# EasyEDA Pro project 信号发生器.eprj

# Schematic SCH_AD9833可编程波形发生器模块
Create Date: 2023-05-23; Page Name: P1; Project Name: 【电赛模块】AD9833可编程波形发生器模块; Schematic Name: SCH_AD9833可编程波形发生器模块; Update Date: 2023-06-13; Company: 深圳嘉立创科技集团股份有限公司; Drawed: LCEDA_02; Page Size: A5; Part Number: JLC-PCB-001; Reviewed: 嘉立创EDA; Version: V1.0
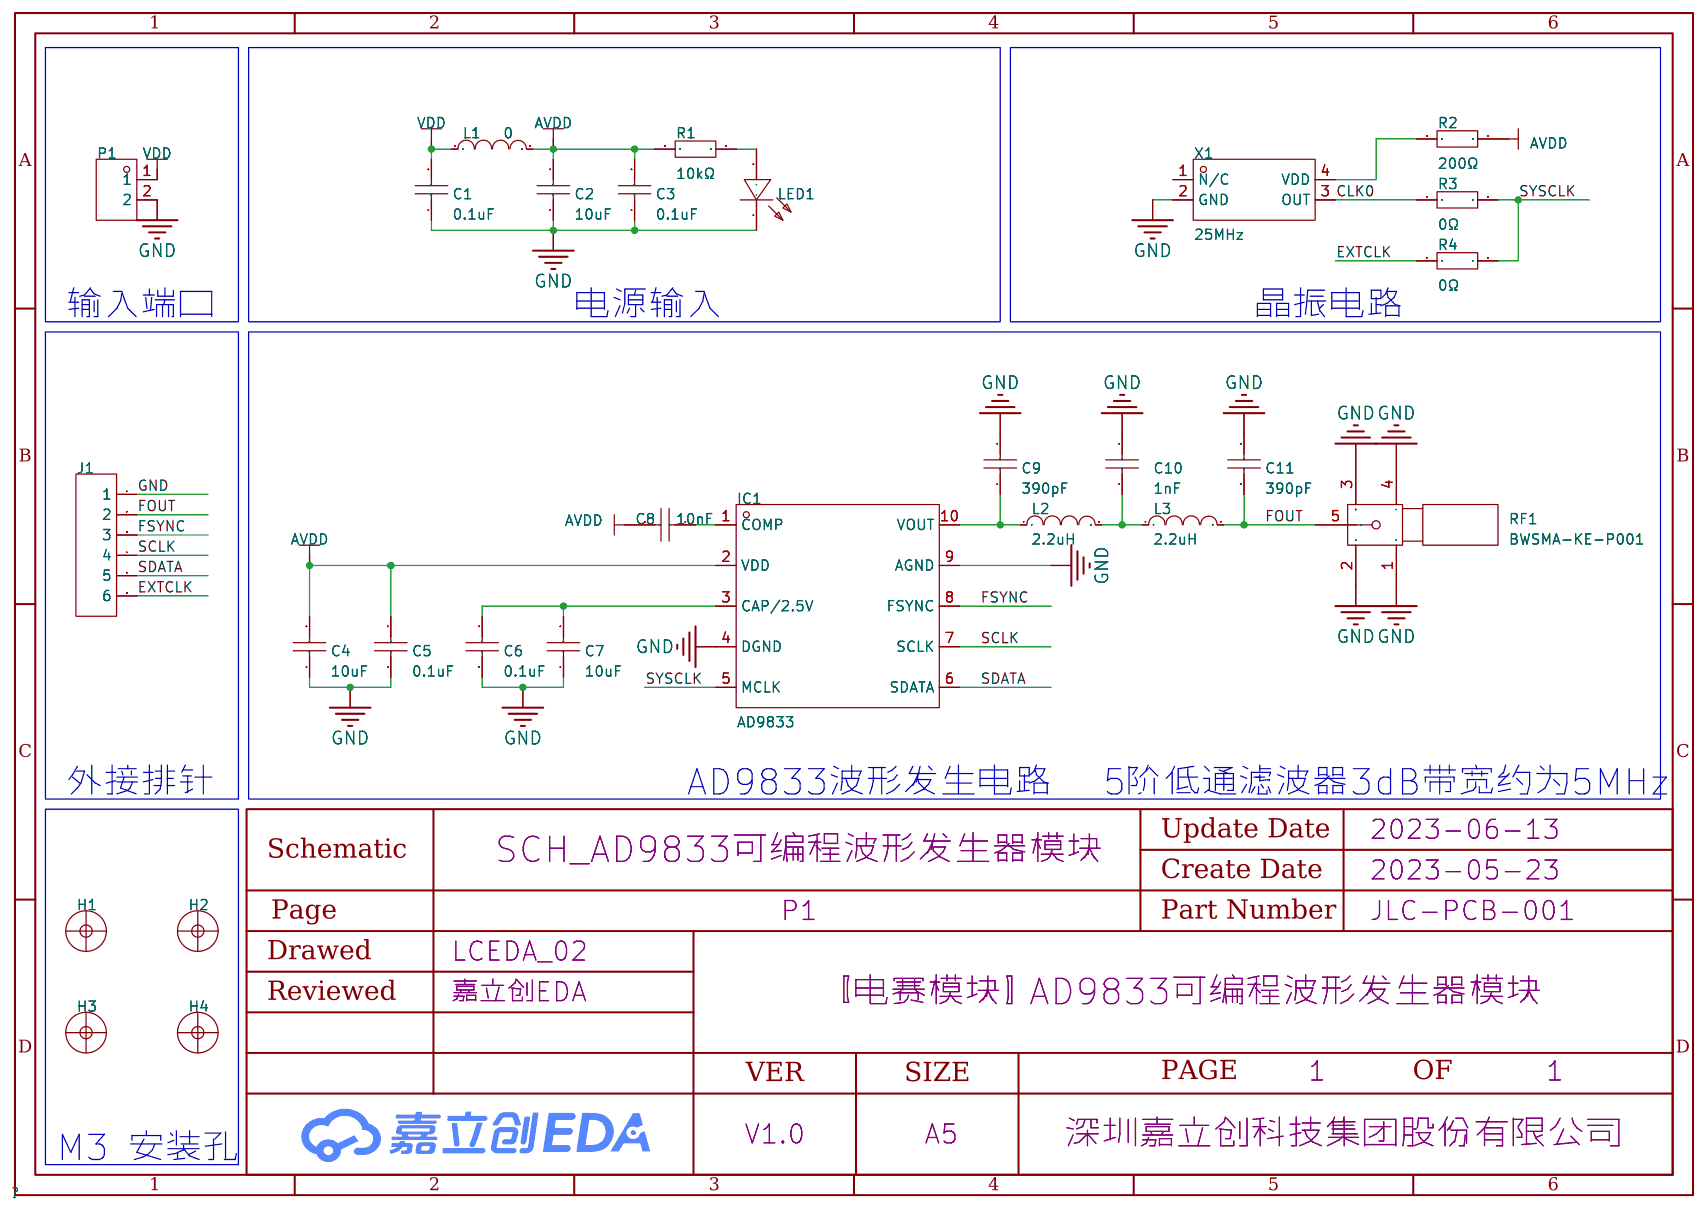
[diagram p0: schematic sheet]

## Parts
C1  0.1uF  [C0805]
C2  10uF  [C0805]
C3  0.1uF  [C0805]
C4  10uF  [C0805]
C5  0.1uF  [C0805]
C6  0.1uF  [C0805]
C7  10uF  [C0805]
C8  10nF  [C0805]
C9  390pF  [C0805]
C10  1nF  [C0805]
C11  390pF  [C0805]
H1  -  [M3X10-6]
H2  -  [M3X10-6]
H3  -  [M3X10-6]
H4  -  [M3X10-6]
IC1  AD9833  [MSOP-10_L3.0-W3.0-P0.50-LS5.0-BL]
J1  2.54-1x6P直针  [HDR-TH_6P-P2.54-V-M-1]
L1  0  [L0805]
L2  2.2uH  [L0805]
L3  2.2uH  [L0805]
LED1  NCD0805R1  [LED0805-RD_RED]
P1  KF301-5.0-2P  [CONN-TH_P5.00_KF301-5.0-2P]
R1  10kΩ  [R0805]
R2  200Ω  [R0805]
R3  0Ω  [R0805]
R4  0Ω  [R0805]
RF1  BWSMA-KE-P001  [SMA-SMD_BWSMA-KE-P001]
X1  25MHz  [OSC-SMD_4P-L7.0-W5.0-BL]

## Library data of the parts
C1 C3 C5 C6 = CL21B104KCFNNNE: 容值:100nF;精度:±10%;额定电压:100V;材质(温度系数):X7R;; LCSC Part Name: 100nF ±10% 100V; Supplier Part: C28233; Manufacturer: SAMSUNG(三星); Supplier Footprint: 0805; JLCPCB Part Class: Basic Part; Datasheet: https://atta.szlcsc.com/upload/public/pdf/source/20160103/1457707716102.pdf; Supplier: LCSC; Tolerance: ±10%; Voltage Rated: 100V; Temperature Coefficient: X7R
C2 C4 C7 = CL21A106KAYNNNE_C15850: 容值:10uF;精度:±10%;额定电压:25V;材质(温度系数):X5R;; LCSC Part Name: 10uF ±10% 25V; Supplier Part: C15850; Manufacturer: SAMSUNG(三星); Manufacturer Part: CL21A106KAYNNNE; Supplier Footprint: 0805; JLCPCB Part Class: Basic Part; Datasheet: https://atta.szlcsc.com/upload/public/pdf/source/20160103/1457707679302.pdf; Supplier: LCSC; Tolerance: ±10%; Voltage Rated: 25V; Temperature Coefficient: X5R
C8 = CL21B103KBANNNC: 容值:10nF;精度:±10%;额定电压:50V;材质(温度系数):X7R;; LCSC Part Name: 10nF ±10% 50V; Supplier Part: C1710; Manufacturer: SAMSUNG(三星); Supplier Footprint: 0805; JLCPCB Part Class: Basic Part; Datasheet: https://atta.szlcsc.com/upload/public/pdf/source/20160103/1457707693082.pdf; Supplier: LCSC; Tolerance: ±10%; Voltage Rated: 50V; Temperature Coefficient: X7R
C9 C11 = CL21C391JBANNNC: 容值:390pF;精度:±5%;额定电压:50V;材质(温度系数):C0G;; LCSC Part Name: 390pF ±5% 50V; Supplier Part: C318736; Manufacturer: SAMSUNG(三星); Supplier Footprint: 0805; JLCPCB Part Class: Extended Part; Datasheet: https://atta.szlcsc.com/upload/public/pdf/source/20190402/C318736_5E6ECF47E5B862995D4CB4A0A4560FE2.pdf; Supplier: LCSC; Tolerance: ±5%; Voltage Rated: 50V; Temperature Coefficient: C0G
C10 = CL21B102KBCNNNC: 容值:1nF;精度:±10%;额定电压:50V;材质(温度系数):X7R;; LCSC Part Name: 1nF ±10% 50V; Supplier Part: C46653; Manufacturer: SAMSUNG(三星); Supplier Footprint: 0805; JLCPCB Part Class: Basic Part; Datasheet: https://atta.szlcsc.com/upload/public/pdf/source/20160103/1457707727583.pdf; Supplier: LCSC; Tolerance: ±10%; Voltage Rated: 50V; Temperature Coefficient: X7R
H1-H4 = M3x10+6: Manufacturer: Shuntian(顺天五金); Supplier Part: C551322; Supplier: LCSC; JLCPCB Part Class: 扩展库
IC1 = AD9833BRMZ-REEL7_C9652: 自宽调谐(最大值):28 b;; LCSC Part Name: AD9833BRMZ; Supplier Part: C9652; Manufacturer: ADI(亚德诺)/LINEAR(凌特); Supplier Footprint: MSOP-10; JLCPCB Part Class: Extended Part; Datasheet: https://atta.szlcsc.com/upload/public/pdf/source/20121029/1457706544172.pdf; Supplier: LCSC; Tuning  Word Width(Max): 28 b
J1 = 2.54-1x6P直针: 排数:单排;总PIN位数:6;间距:2.54mm;插针结构:1x6P;行距:-;安装类型:直插;圆针/方针:方针;额定电流:3A;额定电压:-;配合针长度:-;塑高:-;触头材质:黄铜;触头镀层:-;工作温度范围:-40℃~+105℃;颜色:黑色;; LCSC Part Name: 2.54mm 1x6P 直插 方针; Supplier Part: C37208; Manufacturer: BOOMELE(博穆精密); Supplier Footprint: 直插,P=2.54mm; JLCPCB Part Class: Extended Part; Datasheet: https://atta.szlcsc.com/upload/public/pdf/source/20151109/1457707558014.pdf; Supplier: LCSC; Number of Rows: 单排; Number of Pins: 6; Pitch: 2.54mm; Pin Structure: 1x6P; Mounting Type: 直插; Circluar Pins/Square Pins: 方针; Current Rating (Max): 3A; Contact Material: 黄铜; Operating Temperature Range: -40℃~+105℃; Color: 黑色
L1 = CBG201209U000T: 标称阻抗@测试频率:0Ω@100MHz;直流电阻(RDC):80mΩ;; LCSC Part Name: 单路 0805磁珠 阻抗0Ω@100MHz; Supplier Part: C91037; Manufacturer: FH(风华); Supplier Footprint: 0805; JLCPCB Part Class: Extended Part; Datasheet: https://atta.szlcsc.com/upload/public/pdf/source/20161217/1481939213023.pdf; Supplier: LCSC; Impedance @ Frequency: 0Ω@100MHz; DC Resistance: 80mΩ; Current Rating: 900mA; Circuits: 1
L2 L3 = CMI201209U2R2KT: 电感值:2.2uH;精度:±10%;额定电流:50mA;饱和电流(Isat):-;直流电阻(DCR):600mΩ;; LCSC Part Name: 2.2uH ±10% 600mΩ; Supplier Part: C1043; Manufacturer: FH(风华); Supplier Footprint: 0805; JLCPCB Part Class: Basic Part; Datasheet: https://atta.szlcsc.com/upload/public/pdf/source/20230223/B5A9234764BD8EE53116685FAFCB16FA.pdf; Supplier: LCSC; Tolerance: ±10%; Rated Current: 50mA; DC Resistance (DCR): 600mΩ; Q @ Freq: 35@10MHz; Frequency - Self Resonant: 50MHz
LED1 = NCD0805R1: 发光颜色:红灯;; LCSC Part Name: 红灯; Supplier Part: C84256; Manufacturer: 国星光电; Supplier Footprint: 0805; JLCPCB Part Class: Basic Part; Datasheet: https://atta.szlcsc.com/upload/public/pdf/source/20200820/C84256_F0A75A43B3EAD75808600A0514C76B99.pdf; Supplier: LCSC; Emitted Color: 红灯
P1 = KF301-5.0-2P: 间距:5mm;排数:1;每排PIN数:2;安装方式:直针;额定电流:17A;额定电压:250V;线规 - AWG:14~22;线规 - mm?:1.5;工作温度范围:-30℃~+120℃;颜色:蓝色;; LCSC Part Name: 5mm 排数:1 每排P数:2 直针 可拼接 铜 环保; Supplier Part: C474881; Manufacturer: KEFA(科发); Supplier Footprint: 直插,P=5mm; JLCPCB Part Class: 扩展库; Datasheet: https://atta.szlcsc.com/upload/public/pdf/source/20200115/C474881_883EFE2003339C40FD1BEEEFC9A18423.pdf; Supplier: LCSC; Pitch: 5mm; Number of Rows: 1; Number of PINs Per Row: 2; Mounting Style: 直针; Current Rating (Max): 17A; Voltage Rating (Max): 250V; Wire Gauge - AWG: 14~22; Wire Gauge - mm?: 1.5; Operating Temperature Range: -30℃~+120℃; Color: 蓝色
R1 = 0805W8F1002T5E_C17414: 电阻类型:厚膜电阻;阻值:10kΩ;精度:±1%;功率:125mW;; LCSC Part Name: 10kΩ ±1% 125mW; Supplier Part: C17414; Manufacturer: UNI-ROYAL(厚声); Manufacturer Part: 0805W8F1002T5E; Supplier Footprint: 0805; JLCPCB Part Class: Basic Part; Datasheet: https://atta.szlcsc.com/upload/public/pdf/source/20200306/C422600_1E6D84923E4A46A82E41ADD87F860B5C.pdf; Supplier: LCSC; Type: 厚膜电阻; Tolerance: ±1%; Power(Watts): 125mW; Temperature Coefficient: ±100ppm/℃; Overload Voltage (Max): 150V; Operating Temperature Range: -55℃~+155℃
R2 = 0805W8F2000T5E: 电阻类型:厚膜电阻;阻值:200Ω;精度:±1%;功率:125mW;; LCSC Part Name: 200Ω ±1% 125mW; Supplier Part: C17540; Manufacturer: UNI-ROYAL(厚声); Supplier Footprint: 0805; JLCPCB Part Class: Basic Part; Datasheet: https://atta.szlcsc.com/upload/public/pdf/source/20200306/C422600_1E6D84923E4A46A82E41ADD87F860B5C.pdf; Supplier: LCSC; Type: 厚膜电阻; Tolerance: ±1%; Power(Watts): 125mW; Temperature Coefficient: ±100ppm/℃; Overload Voltage (Max): 150V; Operating Temperature Range: -55℃~+155℃
R3 R4 = 0805W8F0000T5E: 电阻类型:厚膜电阻;阻值:0Ω;精度:±1%;功率:125mW;; LCSC Part Name: 0Ω ±1% 125mW; Supplier Part: C17477; Manufacturer: UNI-ROYAL(厚声); Supplier Footprint: 0805; JLCPCB Part Class: Basic Part; Datasheet: https://atta.szlcsc.com/upload/public/pdf/source/20200306/C422600_1E6D84923E4A46A82E41ADD87F860B5C.pdf; Supplier: LCSC; Type: 厚膜电阻; Tolerance: ±1%; Power(Watts): 125mW; Temperature Coefficient: ±800ppm/℃; Overload Voltage (Max): 150V; Operating Temperature Range: -55℃~+155℃
RF1 = BWSMA-KE-P001: 连接器类型:板端;射频系列:SMA;接口类型:内孔;端口数量:1;阻抗:50Ω;频率-最大值:12.4GHz;样式:偏脚;接口直径:5.2mm;接口长度/高度:-;工作温度范围:-;; LCSC Part Name: SMA 内孔 偏脚 SMA偏脚板端座子; Supplier Part: C496550; Manufacturer: BAT WIRELESS(蝙蝠无线); Supplier Footprint: 插件; JLCPCB Part Class: 扩展库; Datasheet: https://atta.szlcsc.com/upload/public/pdf/source/20200416/C496550_06668BF2E3B968EA39F96D17E7156373.pdf; Supplier: LCSC; Connector Type: 板端; RF Series: SMA; Interface Type: 内孔; Number of Ports: 1; Impedance: 50Ω; Frequency-Max: 12.4GHz; Style: 偏脚; Interface Diameter: 5.2mm
X1 = S7D25.000000A20F30T: 频率:25MHz;输出模式:CMOS;工作电压:5V;供电电流:10mA;频率稳定度(全温):±30ppm;; LCSC Part Name: 25MHz ±20ppm 5V CMOS; Supplier Part: C387028; Manufacturer: SCTF(星通时频); Supplier Footprint: SMD7050-4P; JLCPCB Part Class: Extended Part; Datasheet: https://atta.szlcsc.com/upload/public/pdf/source/20220428/341359299A474B0638F43CB24DB409A3.pdf; Supplier: LCSC; Output Type: CMOS; Supply Voltage: 5V; Supply Current (Max): 10mA; Frequency Stability(Full temperature range): ±30ppm; Operating Temperature: -40℃~+85℃; Frequency Stability: ±20ppm

## Nets
AVDD: C2.2 C3.2 C4.2 C5.2 C8.2 IC1.2(VDD) L1.2 R1.1 R2.2
GND: C1.1 C2.1 C3.1 C4.1 C5.1 C6.1 C7.1 C9.2 C10.2 C11.2 IC1.4(DGND) IC1.9(AGND) J1.1 LED1.1(-) P1.2 RF1.1 RF1.2 RF1.3 RF1.4 X1.2(GND)
VDD: C1.2 L1.1 P1.1
CLK0: R3.1 X1.3(OUT)
EXTCLK: J1.6 R4.1
FOUT: C11.1 J1.2 L3.2 RF1.5
FSYNC: IC1.8(FSYNC) J1.3
SCLK: IC1.7(SCLK) J1.4
SDATA: IC1.6(SDATA) J1.5
SYSCLK: IC1.5(MCLK) R3.2 R4.2
$1N472: C8.1 IC1.1(COMP)
$1N3416: C6.2 C7.2 IC1.3(CAP/2.5V)
$1N4507: LED1.2(+) R1.2
$1N4793: R2.1 X1.4(VDD)
$1N5624: C9.1 IC1.10(VOUT) L2.1
$1N5630: C10.1 L2.2 L3.1

Not connected (* = marked no-connect by the designer): X1 1(N/C)

## Notes on the sheet
- 输入端口
- 电源输入
- 晶振电路
- 外接排针
- AD9833波形发生电路
- 5阶低通滤波器3dB带宽约为5MHz
- M3 安装孔

# Schematic SCH_AD9833可编程波形发生器模块_1
Create Date: 2023-05-25; Page Name: P1; Project Name: 【电赛模块】AD9833可编程波形发生器模块; Schematic Name: SCH_AD9833可编程波形发生器模块_1; Update Date: 2023-06-13; Company: 深圳嘉立创科技集团股份有限公司; Drawed: LCEDA_02; Page Size: A5; Part Number: JLC-PCB-001; Reviewed: 嘉立创EDA; Version: V1.0
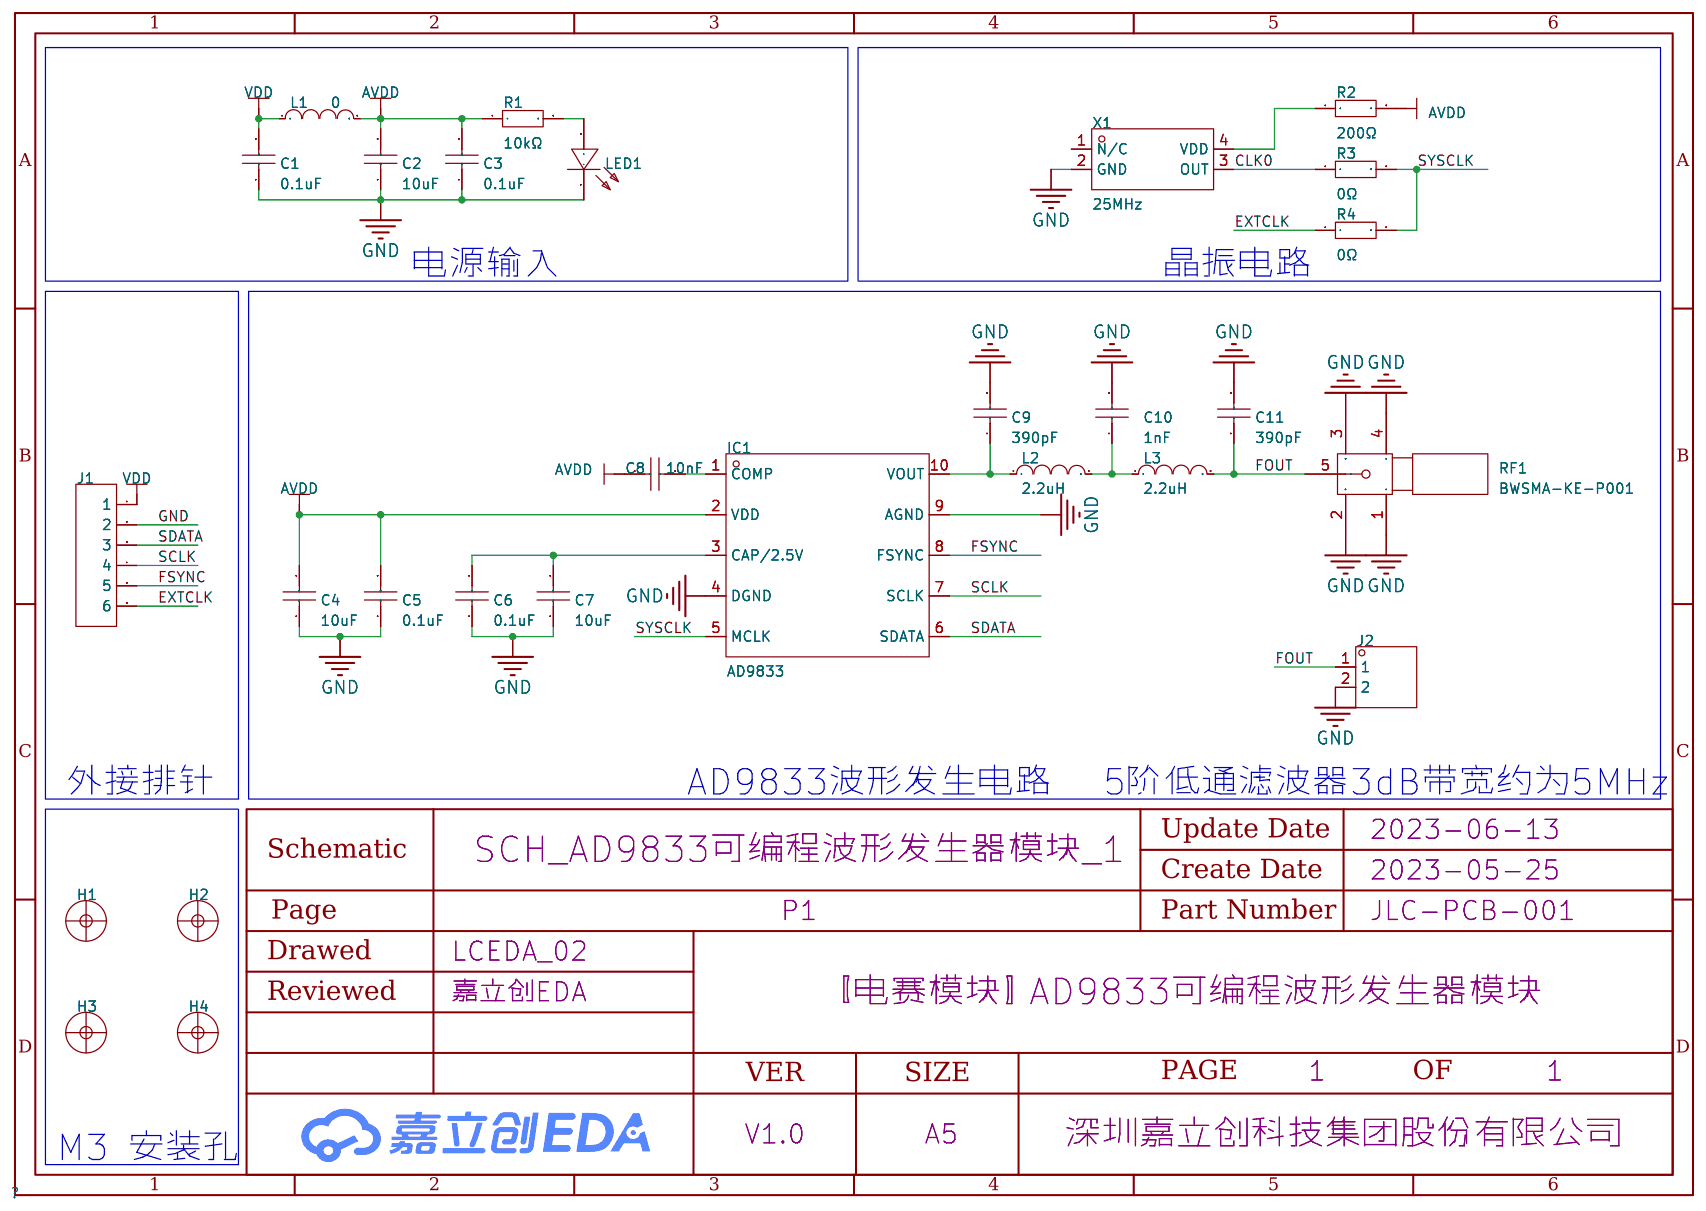
[diagram p1: schematic sheet]

## Parts
C1  0.1uF  [C0805]
C2  10uF  [C0805]
C3  0.1uF  [C0805]
C4  10uF  [C0805]
C5  0.1uF  [C0805]
C6  0.1uF  [C0805]
C7  10uF  [C0805]
C8  10nF  [C0805]
C9  390pF  [C0805]
C10  1nF  [C0805]
C11  390pF  [C0805]
H1  -  [M3X10-6]
H2  -  [M3X10-6]
H3  -  [M3X10-6]
H4  -  [M3X10-6]
IC1  AD9833  [MSOP-10_L3.0-W3.0-P0.50-LS5.0-BL]
J1  2.54-1x6P直针  [HDR-TH_6P-P2.54-V-M-1]
J2  -  [HDR-TH_2P-P2.54-V-M-1]
L1  0  [L0805]
L2  2.2uH  [L0805]
L3  2.2uH  [L0805]
LED1  NCD0805R1  [LED0805-RD_RED]
R1  10kΩ  [R0805]
R2  200Ω  [R0805]
R3  0Ω  [R0805]
R4  0Ω  [R0805]
RF1  BWSMA-KE-P001  [SMA-SMD_BWSMA-KE-P001]
X1  25MHz  [OSC-SMD_4P-L7.0-W5.0-BL]

## Library data of the parts
C1 C3 C5 C6 = CL21B104KCFNNNE: 容值:100nF;精度:±10%;额定电压:100V;材质(温度系数):X7R;; LCSC Part Name: 100nF ±10% 100V; Supplier Part: C28233; Manufacturer: SAMSUNG(三星); Supplier Footprint: 0805; JLCPCB Part Class: Basic Part; Datasheet: https://atta.szlcsc.com/upload/public/pdf/source/20160103/1457707716102.pdf; Supplier: LCSC; Tolerance: ±10%; Voltage Rated: 100V; Temperature Coefficient: X7R
C2 C4 C7 = CL21A106KAYNNNE_C15850: 容值:10uF;精度:±10%;额定电压:25V;材质(温度系数):X5R;; LCSC Part Name: 10uF ±10% 25V; Supplier Part: C15850; Manufacturer: SAMSUNG(三星); Manufacturer Part: CL21A106KAYNNNE; Supplier Footprint: 0805; JLCPCB Part Class: Basic Part; Datasheet: https://atta.szlcsc.com/upload/public/pdf/source/20160103/1457707679302.pdf; Supplier: LCSC; Tolerance: ±10%; Voltage Rated: 25V; Temperature Coefficient: X5R
C8 = CL21B103KBANNNC: 容值:10nF;精度:±10%;额定电压:50V;材质(温度系数):X7R;; LCSC Part Name: 10nF ±10% 50V; Supplier Part: C1710; Manufacturer: SAMSUNG(三星); Supplier Footprint: 0805; JLCPCB Part Class: Basic Part; Datasheet: https://atta.szlcsc.com/upload/public/pdf/source/20160103/1457707693082.pdf; Supplier: LCSC; Tolerance: ±10%; Voltage Rated: 50V; Temperature Coefficient: X7R
C9 C11 = CL21C391JBANNNC: 容值:390pF;精度:±5%;额定电压:50V;材质(温度系数):C0G;; LCSC Part Name: 390pF ±5% 50V; Supplier Part: C318736; Manufacturer: SAMSUNG(三星); Supplier Footprint: 0805; JLCPCB Part Class: Extended Part; Datasheet: https://atta.szlcsc.com/upload/public/pdf/source/20190402/C318736_5E6ECF47E5B862995D4CB4A0A4560FE2.pdf; Supplier: LCSC; Tolerance: ±5%; Voltage Rated: 50V; Temperature Coefficient: C0G
C10 = CL21B102KBCNNNC: 容值:1nF;精度:±10%;额定电压:50V;材质(温度系数):X7R;; LCSC Part Name: 1nF ±10% 50V; Supplier Part: C46653; Manufacturer: SAMSUNG(三星); Supplier Footprint: 0805; JLCPCB Part Class: Basic Part; Datasheet: https://atta.szlcsc.com/upload/public/pdf/source/20160103/1457707727583.pdf; Supplier: LCSC; Tolerance: ±10%; Voltage Rated: 50V; Temperature Coefficient: X7R
H1-H4 = M3x10+6: Manufacturer: Shuntian(顺天五金); Supplier Part: C551322; Supplier: LCSC; JLCPCB Part Class: 扩展库
IC1 = AD9833BRMZ-REEL7_C9652: 自宽调谐(最大值):28 b;; LCSC Part Name: AD9833BRMZ; Supplier Part: C9652; Manufacturer: ADI(亚德诺)/LINEAR(凌特); Supplier Footprint: MSOP-10; JLCPCB Part Class: Extended Part; Datasheet: https://atta.szlcsc.com/upload/public/pdf/source/20121029/1457706544172.pdf; Supplier: LCSC; Tuning  Word Width(Max): 28 b
J1 = 2.54-1x6P直针: 排数:单排;总PIN位数:6;间距:2.54mm;插针结构:1x6P;行距:-;安装类型:直插;圆针/方针:方针;额定电流:3A;额定电压:-;配合针长度:-;塑高:-;触头材质:黄铜;触头镀层:-;工作温度范围:-40℃~+105℃;颜色:黑色;; LCSC Part Name: 2.54mm 1x6P 直插 方针; Supplier Part: C37208; Manufacturer: BOOMELE(博穆精密); Supplier Footprint: 直插,P=2.54mm; JLCPCB Part Class: Extended Part; Datasheet: https://atta.szlcsc.com/upload/public/pdf/source/20151109/1457707558014.pdf; Supplier: LCSC; Number of Rows: 单排; Number of Pins: 6; Pitch: 2.54mm; Pin Structure: 1x6P; Mounting Type: 直插; Circluar Pins/Square Pins: 方针; Current Rating (Max): 3A; Contact Material: 黄铜; Operating Temperature Range: -40℃~+105℃; Color: 黑色
J2 = HDR-M_2.54_1x2P: Supplier Part: C124375; Supplier Footprint: 插件; Supplier: LCSC; Manufacturer: Ckmtw(灿科盟); Manufacturer Part: 2.54-1x2P直针
L1 = CBG201209U000T: 标称阻抗@测试频率:0Ω@100MHz;直流电阻(RDC):80mΩ;; LCSC Part Name: 单路 0805磁珠 阻抗0Ω@100MHz; Supplier Part: C91037; Manufacturer: FH(风华); Supplier Footprint: 0805; JLCPCB Part Class: Extended Part; Datasheet: https://atta.szlcsc.com/upload/public/pdf/source/20161217/1481939213023.pdf; Supplier: LCSC; Impedance @ Frequency: 0Ω@100MHz; DC Resistance: 80mΩ; Current Rating: 900mA; Circuits: 1
L2 L3 = CMI201209U2R2KT: 电感值:2.2uH;精度:±10%;额定电流:50mA;饱和电流(Isat):-;直流电阻(DCR):600mΩ;; LCSC Part Name: 2.2uH ±10% 600mΩ; Supplier Part: C1043; Manufacturer: FH(风华); Supplier Footprint: 0805; JLCPCB Part Class: Basic Part; Datasheet: https://atta.szlcsc.com/upload/public/pdf/source/20230223/B5A9234764BD8EE53116685FAFCB16FA.pdf; Supplier: LCSC; Tolerance: ±10%; Rated Current: 50mA; DC Resistance (DCR): 600mΩ; Q @ Freq: 35@10MHz; Frequency - Self Resonant: 50MHz
LED1 = NCD0805R1: 发光颜色:红灯;; LCSC Part Name: 红灯; Supplier Part: C84256; Manufacturer: 国星光电; Supplier Footprint: 0805; JLCPCB Part Class: Basic Part; Datasheet: https://atta.szlcsc.com/upload/public/pdf/source/20200820/C84256_F0A75A43B3EAD75808600A0514C76B99.pdf; Supplier: LCSC; Emitted Color: 红灯
R1 = 0805W8F1002T5E_C17414: 电阻类型:厚膜电阻;阻值:10kΩ;精度:±1%;功率:125mW;; LCSC Part Name: 10kΩ ±1% 125mW; Supplier Part: C17414; Manufacturer: UNI-ROYAL(厚声); Manufacturer Part: 0805W8F1002T5E; Supplier Footprint: 0805; JLCPCB Part Class: Basic Part; Datasheet: https://atta.szlcsc.com/upload/public/pdf/source/20200306/C422600_1E6D84923E4A46A82E41ADD87F860B5C.pdf; Supplier: LCSC; Type: 厚膜电阻; Tolerance: ±1%; Power(Watts): 125mW; Temperature Coefficient: ±100ppm/℃; Overload Voltage (Max): 150V; Operating Temperature Range: -55℃~+155℃
R2 = 0805W8F2000T5E: 电阻类型:厚膜电阻;阻值:200Ω;精度:±1%;功率:125mW;; LCSC Part Name: 200Ω ±1% 125mW; Supplier Part: C17540; Manufacturer: UNI-ROYAL(厚声); Supplier Footprint: 0805; JLCPCB Part Class: Basic Part; Datasheet: https://atta.szlcsc.com/upload/public/pdf/source/20200306/C422600_1E6D84923E4A46A82E41ADD87F860B5C.pdf; Supplier: LCSC; Type: 厚膜电阻; Tolerance: ±1%; Power(Watts): 125mW; Temperature Coefficient: ±100ppm/℃; Overload Voltage (Max): 150V; Operating Temperature Range: -55℃~+155℃
R3 R4 = 0805W8F0000T5E: 电阻类型:厚膜电阻;阻值:0Ω;精度:±1%;功率:125mW;; LCSC Part Name: 0Ω ±1% 125mW; Supplier Part: C17477; Manufacturer: UNI-ROYAL(厚声); Supplier Footprint: 0805; JLCPCB Part Class: Basic Part; Datasheet: https://atta.szlcsc.com/upload/public/pdf/source/20200306/C422600_1E6D84923E4A46A82E41ADD87F860B5C.pdf; Supplier: LCSC; Type: 厚膜电阻; Tolerance: ±1%; Power(Watts): 125mW; Temperature Coefficient: ±800ppm/℃; Overload Voltage (Max): 150V; Operating Temperature Range: -55℃~+155℃
RF1 = BWSMA-KE-P001: 连接器类型:板端;射频系列:SMA;接口类型:内孔;端口数量:1;阻抗:50Ω;频率-最大值:12.4GHz;样式:偏脚;接口直径:5.2mm;接口长度/高度:-;工作温度范围:-;; LCSC Part Name: SMA 内孔 偏脚 SMA偏脚板端座子; Supplier Part: C496550; Manufacturer: BAT WIRELESS(蝙蝠无线); Supplier Footprint: 插件; JLCPCB Part Class: 扩展库; Datasheet: https://atta.szlcsc.com/upload/public/pdf/source/20200416/C496550_06668BF2E3B968EA39F96D17E7156373.pdf; Supplier: LCSC; Connector Type: 板端; RF Series: SMA; Interface Type: 内孔; Number of Ports: 1; Impedance: 50Ω; Frequency-Max: 12.4GHz; Style: 偏脚; Interface Diameter: 5.2mm
X1 = S7D25.000000A20F30T: 频率:25MHz;输出模式:CMOS;工作电压:5V;供电电流:10mA;频率稳定度(全温):±30ppm;; LCSC Part Name: 25MHz ±20ppm 5V CMOS; Supplier Part: C387028; Manufacturer: SCTF(星通时频); Supplier Footprint: SMD7050-4P; JLCPCB Part Class: Extended Part; Datasheet: https://atta.szlcsc.com/upload/public/pdf/source/20220428/341359299A474B0638F43CB24DB409A3.pdf; Supplier: LCSC; Output Type: CMOS; Supply Voltage: 5V; Supply Current (Max): 10mA; Frequency Stability(Full temperature range): ±30ppm; Operating Temperature: -40℃~+85℃; Frequency Stability: ±20ppm

## Nets
AVDD: C2.2 C3.2 C4.2 C5.2 C8.2 IC1.2(VDD) L1.2 R1.1 R2.2
GND: C1.1 C2.1 C3.1 C4.1 C5.1 C6.1 C7.1 C9.2 C10.2 C11.2 IC1.4(DGND) IC1.9(AGND) J1.2 J2.2 LED1.1(-) RF1.1 RF1.2 RF1.3 RF1.4 X1.2(GND)
VDD: C1.2 J1.1 L1.1
CLK0: R3.1 X1.3(OUT)
EXTCLK: J1.6 R4.1
FOUT: C11.1 J2.1 L3.2 RF1.5
FSYNC: IC1.8(FSYNC) J1.5
SCLK: IC1.7(SCLK) J1.4
SDATA: IC1.6(SDATA) J1.3
SYSCLK: IC1.5(MCLK) R3.2 R4.2
$1N472: C8.1 IC1.1(COMP)
$1N3416: C6.2 C7.2 IC1.3(CAP/2.5V)
$1N4507: LED1.2(+) R1.2
$1N4793: R2.1 X1.4(VDD)
$1N5624: C9.1 IC1.10(VOUT) L2.1
$1N5630: C10.1 L2.2 L3.1

Not connected (* = marked no-connect by the designer): X1 1(N/C)

## Notes on the sheet
- 电源输入
- 晶振电路
- 外接排针
- AD9833波形发生电路
- 5阶低通滤波器3dB带宽约为5MHz
- M3 安装孔

# Board PCB_AD9833可编程波形发生器模块
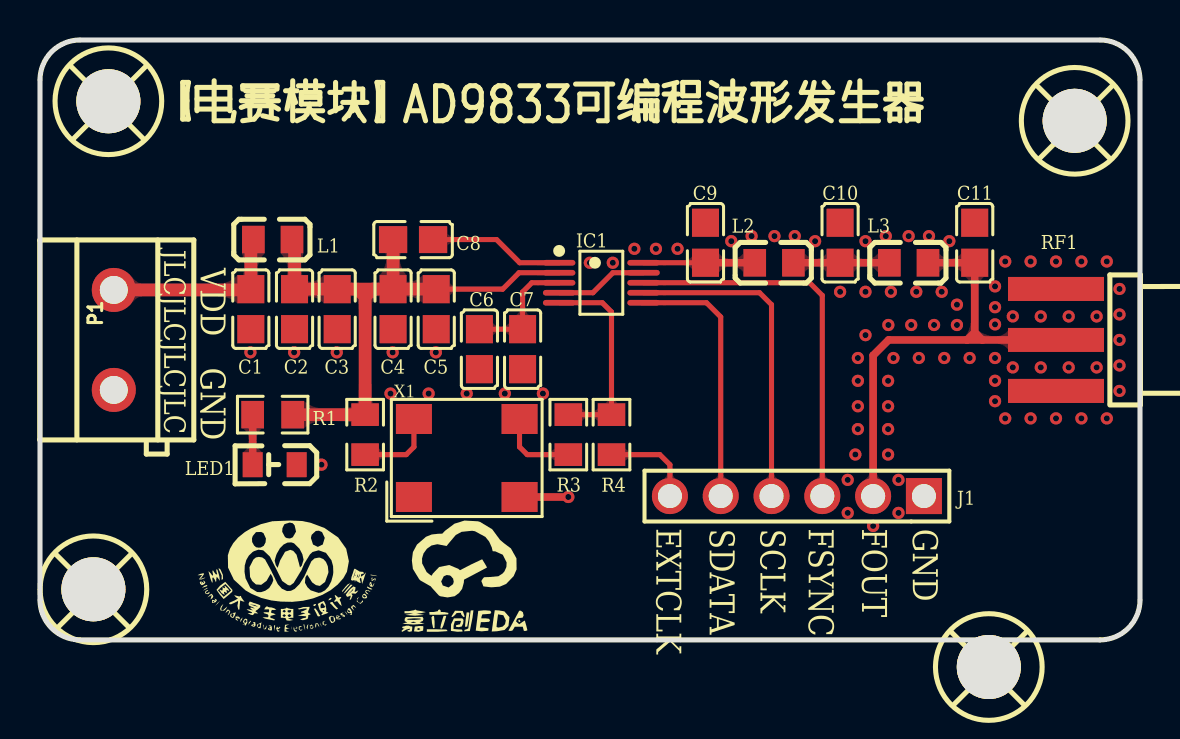
[diagram p2: board, top side]
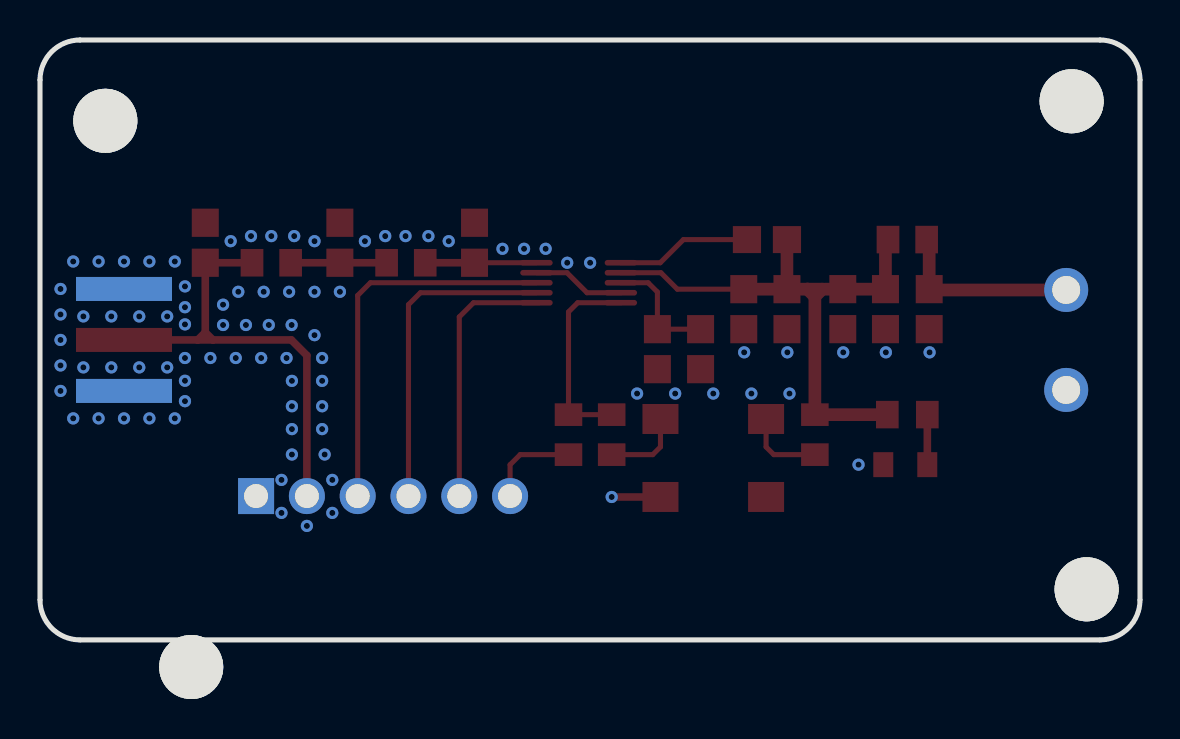
[diagram p3: board, bottom side, seen from below]

Outline 55 x 30 mm; copper layers: Top Layer, Bottom Layer. Coordinates in mm from the lower left corner of the outline.
Outline path: 0,28 0,2 arc(0.59,0.59) 2,0 53,0 arc(54.41,0.59) 55,2 55,28 arc(54.41,29.41) 53,30 2,30 arc(0.59,29.41) 0,28
Stack: Top Layer 0.035mm / Dielectric1 1.51mm FR4 er 4.5 / Bottom Layer 0.035mm

## Design rules (mm)
template: JLCPCB Capability(Two Layers Board)
spacing copperThickness1oz (default): track to track 0.102, other pairs 0.152 to 0.3
spacing copperThickness2oz: track to track 0.203, other pairs 0.152 to 0.3
track width copperThickness1oz (default): min 0.127, default 0.254, max 2.54
track width copperThickness2oz: min 0.203, default 0.254, max 2.54
differential pair differentialPair (default): width min 0.127, default 0.254, max 2.54; gap min 0.152, default 0.152
via viaSize (default): diameter min 0.5, default 0.61, max 10; hole min 0.3, default 0.305, max 6.3

## Placement (name value [footprint] x y rotation side)
C1  0.1uF  [C0805]  10.54 16.54 90 top
C2  10uF  [C0805]  12.73 16.54 90 top
C3  0.1uF  [C0805]  14.86 16.54 90 top
C4  10uF  [C0805]  17.65 16.54 90 top
C5  0.1uF  [C0805]  19.81 16.54 90 top
C6  0.1uF  [C0805]  21.97 14.54 90 top
C7  10uF  [C0805]  24.13 14.54 90 top
C8  10nF  [C0805]  18.65 20.02 180 top
C9  390pF  [C0805]  33.27 19.86 90 top
C10  1nF  [C0805]  40 19.86 90 top
C11  390pF  [C0805]  46.74 19.86 90 top
H1  -  [M3X10-6]  3 3 0 top
H2  -  [M3X10-6#3]  52 3 0 top
H3  -  [M3X10-6#4]  52 27 0 top
H4  -  [M3X10-6#2]  3 27 0 top
IC1  AD9833  [MSOP-10_L3.0-W3.0-P0.50-LS5.0-BL]  28.07 17.86 270 top
J1  2.54-1x6P直针  [HDR-TH_6P-P2.54-V-M-1]  37.85 7.19 180 top
L1  0  [L0805]  11.63 20.02 0 top
L2  2.2uH  [L0805]  36.7 18.86 0 top
L3  2.2uH  [L0805]  43.43 18.86 0 top
LED1  NCD0805R1  [LED0805-RD_RED]  11.74 8.76 180 top
P1  KF301-5.0-2P  [CONN-TH_P5.00_KF301-5.0-2P]  3.69 15 270 top
R1  10kΩ  [R0805]  11.63 11.26 180 top
R2  200Ω  [R0805]  16.26 10.26 90 top
R3  0Ω  [R0805]  26.42 10.26 90 top
R4  0Ω  [R0805]  28.57 10.26 90 top
RF1  BWSMA-KE-P001  [SMA-SMD_BWSMA-KE-P001]  50.8 15 0 top
X1  25MHz  [OSC-SMD_4P-L7.0-W5.0-BL]  21.34 9.1 0 top

## Footprints (pads in the part's own frame, mm; a bottom-side part is the same pattern mirrored in y, then rotated)
C0805
  rect 1.41x1.35 smd: 1(-1,0) 2(1,0)
CONN-TH_P5.00_KF301-5.0-2P
  round 2.2 hole 1.4: 1(-2.5,0) 2(2.5,0)
HDR-TH_6P-P2.54-V-M-1
  rect 1.8x1.8 hole 1.2: 1(-6.35,0)
  round 1.8 hole 1.2: 2(-3.81,0) 3(-1.27,0) 4(1.27,0) 5(3.81,0) 6(6.35,0)
L0805
  rect 1.133x1.377 smd: 1(-0.966,0) 2(0.966,0)
LED0805-RD_RED
  rect 1x1.25 smd: 1(-1.1,0) 2(1.1,0)
M3X10-6
  round 3.2 hole 3.2: 1(-0.33,-0.47)
M3X10-6#2
  round 3.2 hole 3.2: 1(0.419,-0.064)
M3X10-6#3
  round 3.2 hole 3.2: 1(-4.559,-4.356)
M3X10-6#4
  round 3.2 hole 3.2: 1(-0.267,-1.042)
MSOP-10_L3.0-W3.0-P0.50-LS5.0-BL
  oval 0.28x1.62 smd: 1(-1,-2.11) 2(-0.5,-2.11) 3(0,-2.11) 4(0.5,-2.11) 5(1,-2.11) 6(1,2.11) 7(0.5,2.11) 8(0,2.11) 9(-0.5,2.11) 10(-1,2.11)
OSC-SMD_4P-L7.0-W5.0-BL
  rect 1.8x1.5 smd: 1(-2.64,-1.95) 2(2.64,-1.95) 3(2.64,1.95) 4(-2.64,1.95)
R0805
  rect 1.133x1.377 smd: 1(-1,0) 2(1,0)
SMA-SMD_BWSMA-KE-P001
  rect 4.8x1.2 smd: 1(0,-2.55) 2(0,2.55) 5(0,0)
  rect 4.8x1.2 smd far side: 3(0,2.55) 4(0,-2.55)

## Nets
As in the schematic.

Pads without a net: H1 1; H2 1; H3 1; H4 1; X1 1

## Via types
v1: diameter 0.61, hole 0.305, Top Layer to Bottom Layer, 85 vias

## Routing (per net, layer and track width the routed paths; a pad name or vN(x,y) marks a point on that pad's centre or on a via; arc(x,y) is an arc through that point)
AVDD: length 28.5
  Top Layer w0.254: IC1.2 23.95,18.36 23.13,17.54 C5.2
  Top Layer w0.635: 16.63,17.54 15.88,17.54 16.26,17.17 ; 16.63,17.54 17.14,17.54 ; 16.63,17.54 16.26,17.17 ; C8.2 C4.2 C5.2 ; 16.26,17.17 R2.2 R1.1 ; 15.76,17.54 C3.2 C2.2 12.73,19.89 L1.2
GND: length 7.1
  Top Layer w0.254: 30.18,18.36 28.65,18.36 27.65,17.36 IC1.4
  Top Layer w0.381: 23.98,7.15 v1(26.42,7.15)
  vias: v1(10.52,14.38) v1(12.71,14.38) v1(14.07,8.76) v1(14.84,14.38) v1(17.53,12.32) v1(17.63,14.38) v1(19.43,12.32) v1(19.79,14.38) v1(21.34,12.32) v1(23.24,12.32) v1(25.15,12.32) v1(27.49,18.86) v1(28.64,18.86) v1(29.72,19.56) v1(30.8,19.56) v1(31.88,19.56) v1(34.56,19.94) v1(35.58,20.19) v1(36.72,20.19) v1(37.74,20.19) v1(38.75,19.94) v1(40,17.41) v1(40.39,8) v1(40.39,6.35) v1(40.77,9.27) v1(40.89,14.1) v1(40.89,12.95) v1(40.89,11.68) v1(40.89,10.54) v1(41.28,19.94) v1(41.28,17.41) v1(41.28,15.24) v1(41.66,5.7) v1(42.29,20.19) v1(42.42,15.75) v1(42.4,12.95) v1(42.4,11.68) v1(42.4,10.54) v1(42.4,9.27) v1(42.54,17.41) v1(42.67,14.1) v1(42.93,8) v1(42.93,6.35) v1(43.43,20.19) v1(43.56,15.75) v1(43.81,17.41) v1(43.94,14.1) v1(44.45,20.19) v1(44.7,15.75) v1(45.09,17.41) v1(45.21,14.1) v1(45.47,19.94) v1(45.85,16.76) v1(45.85,15.75) v1(46.48,14.1) v1(47.75,17.68) v1(47.75,16.64) v1(47.75,15.78) v1(47.75,14.1) v1(47.75,12.96) v1(47.75,11.94) v1(48.26,18.92) v1(48.26,11.08) v1(48.64,16.18) v1(48.64,13.63) v1(49.53,18.92) v1(49.53,11.08) v1(50.04,16.18) v1(50.04,13.63) v1(50.8,18.92) v1(50.8,11.08) v1(51.44,16.18) v1(51.44,13.63) v1(52.07,18.92) v1(52.07,11.08) v1(52.83,16.18) v1(52.83,13.63) v1(53.34,18.92) v1(53.34,11.08) v1(53.97,17.55) v1(53.97,16.28) v1(53.97,15) v1(53.97,13.72) v1(53.97,12.45)
VDD: length 9.4
  Top Layer w0.635: L1.1 10.54,19.89 C1.2 arc(10.53,17.51) 10.5,17.5 P1.1
CLK0: length 4
  Top Layer w0.254: R3.1 24.36,9.26 23.98,9.65 X1.3
EXTCLK: length 4.7
  Top Layer w0.254: 31.5,7.23 31.5,8.76 30.99,9.26 R4.1
FOUT: length 23.4
  Top Layer w0.381: RF1.5 47.12,15 ; 47.12,15 46.35,15 ; 47.12,15 46.74,15.38 ; L3.2 C11.1 46.74,15.38 ; 46.35,15 46.74,15.38 ; 46.35,15 42.43,15 41.66,14.22 J1.2
FSYNC: length 19.2
  Top Layer w0.254: 30.18,17.86 38.48,17.86 39.12,17.22 39.12,7.23
SCLK: length 16.2
  Top Layer w0.254: 30.18,17.36 35.98,17.36 36.58,16.76 36.58,7.23
SDATA: length 13.2
  Top Layer w0.254: 30.05,16.86 33.33,16.86 34.04,16.15 34.04,7.23
SYSCLK: length 10.1
  Top Layer w0.254: IC1.5 28.12,16.86 28.57,16.4 R4.2 R3.2
$1N472: length 6.8
  Top Layer w0.254: IC1.1 23.99,18.86 22.83,20.02 C8.1
$1N3416: length 6
  Top Layer w0.254: C6.2 C7.2 24.13,17.4 24.59,17.86 IC1.3
$1N4507: length 2.5
  Top Layer w0.381: R1.2 10.63,8.76
$1N4793: length 4
  Top Layer w0.254: R2.1 18.31,9.26 18.7,9.65 X1.4
$1N5624: length 5.6
  Top Layer w0.254: 30.18,18.86 C9.1
  Top Layer w0.381: C9.1 L2.1
$1N5630: length 4.8
  Top Layer w0.381: L2.2 C10.1 L3.1

## Copper pours and planes (outline as drawn; the poured copper is in the pictures)
GND on Top Layer: 0,28 0.02,28.28 0.08,28.56 0.18,28.83 0.32,29.08 0.49,29.31 0.69,29.51 0.92,29.68 1.17,29.82 1.44,29.92 1.72,29.98 2,30 53,30 53.28,29.98 53.56,29.92 53.83,29.82 54.08,29.68 54.31,29.51 54.51,29.31 54.68,29.08 54.82,28.83 54.92,28.56 54.98,28.28 55,28 55,2 54.98,1.72 54.92,1.44 54.82,1.17 54.68,0.92 54.51,0.69 54.31,0.49 54.08,0.32 53.83,0.18 53.56,0.08 53.28,0.02 53,0 2,0 1.72,0.02 1.44,0.08 1.17,0.18 0.92,0.32 0.69,0.49 0.49,0.69 0.32,0.92 0.18,1.17 0.08,1.44 0.02,1.72 0,2
GND on Bottom Layer: 0,28 0.02,28.28 0.08,28.56 0.18,28.83 0.32,29.08 0.49,29.31 0.69,29.51 0.92,29.68 1.17,29.82 1.44,29.92 1.72,29.98 2,30 53,30 53.28,29.98 53.56,29.92 53.83,29.82 54.08,29.68 54.31,29.51 54.51,29.31 54.68,29.08 54.82,28.83 54.92,28.56 54.98,28.28 55,28 55,2 54.98,1.72 54.92,1.44 54.82,1.17 54.68,0.92 54.51,0.69 54.31,0.49 54.08,0.32 53.83,0.18 53.56,0.08 53.28,0.02 53,0 2,0 1.72,0.02 1.44,0.08 1.17,0.18 0.92,0.32 0.69,0.49 0.49,0.69 0.32,0.92 0.18,1.17 0.08,1.44 0.02,1.72 0,2

Small or netless copper shapes (teardrops, artwork), in the pictures only: 61 on Top Layer

## Text on the board
Top Silkscreen Layer: JLCJLCJLCJLC | VDD | GND | EXTCLK | SDATA | SCLK | FSYNC | FOUT | 【电赛模块】AD9833可编程波形发生器

# Board PCB_AD9833可编程波形发生器模块_1
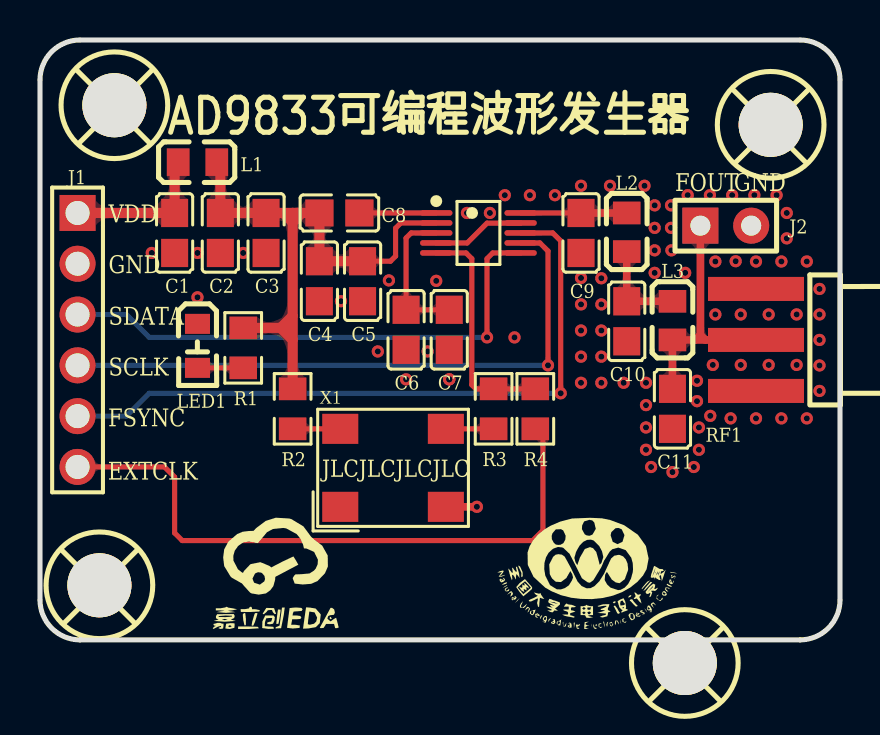
[diagram p4: board, top side]
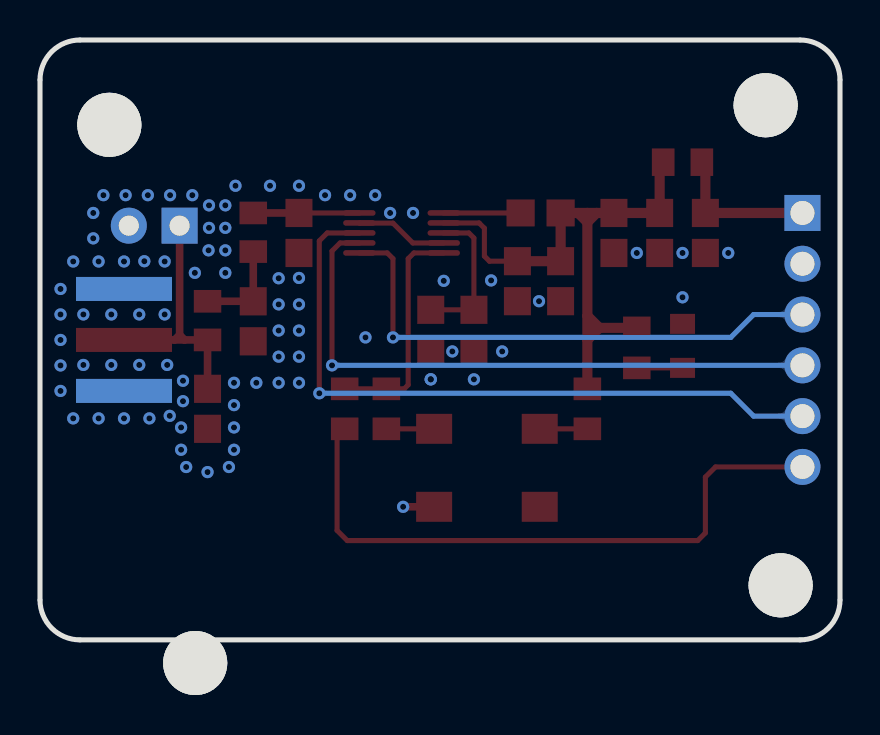
[diagram p5: board, bottom side, seen from below]

Outline 40 x 30 mm; copper layers: Top Layer, Bottom Layer. Coordinates in mm from the lower left corner of the outline.
Outline path: 0,28 0,2 arc(0.59,0.59) 2,0 38,0 arc(39.41,0.59) 40,2 40,28 arc(39.41,29.41) 38,30 2,30 arc(0.59,29.41) 0,28
Stack: Top Layer 0.035mm / Dielectric1 1.51mm FR4 er 4.5 / Bottom Layer 0.035mm

## Design rules (mm)
template: JLCPCB Capability(Two Layers Board)
spacing copperThickness1oz (default): track to track 0.102, other pairs 0.152 to 0.3
spacing copperThickness2oz: track to track 0.203, other pairs 0.152 to 0.3
track width copperThickness1oz (default): min 0.127, default 0.254, max 2.54
track width copperThickness2oz: min 0.203, default 0.254, max 2.54
differential pair differentialPair (default): width min 0.127, default 0.254, max 2.54; gap min 0.152, default 0.152
via viaSize (default): diameter min 0.5, default 0.61, max 10; hole min 0.3, default 0.305, max 6.3

## Placement (name value [footprint] x y rotation side)
C1  0.1uF  [C0805]  6.73 20.35 90 top
C2  10uF  [C0805]  9.02 20.35 90 top
C3  0.1uF  [C0805]  11.3 20.35 90 top
C4  10uF  [C0805]  13.97 17.94 90 top
C5  0.1uF  [C0805]  16.13 17.94 90 top
C6  0.1uF  [C0805]  18.3 15.51 90 top
C7  10uF  [C0805]  20.46 15.51 90 top
C8  10nF  [C0805]  14.97 21.35 180 top
C9  390pF  [C0805]  27.05 20.35 270 top
C10  1nF  [C0805]  29.34 15.93 270 top
C11  390pF  [C0805]  31.62 11.56 270 top
H1  -  [M3X10-6]  3.3 3.2 0 top
H2  -  [m3x10-6]  36.8 3.2 0 top
H3  -  [m3x10-6#2]  36.8 26.8 0 top
H4  -  [m3x10-6#3]  3.3 26.8 0 top
IC1  AD9833  [MSOP-10_L3.0-W3.0-P0.50-LS5.0-BL]  21.92 20.35 270 top
J1  2.54-1x6P直针  [HDR-TH_6P-P2.54-V-M-1]  1.88 15 270 top
J2  -  [HDR-TH_2P-P2.54-V-M-1]  34.29 20.72 0 top
L1  0  [L0805]  7.87 23.89 0 top
L2  2.2uH  [L0805]  29.34 20.38 270 top
L3  2.2uH  [L0805]  31.62 15.97 270 top
LED1  NCD0805R1  [LED0805-RD_RED]  7.87 14.7 270 top
R1  10kΩ  [R0805]  10.16 14.6 270 top
R2  200Ω  [R0805]  12.63 11.56 90 top
R3  0Ω  [R0805]  22.68 11.56 90 top
R4  0Ω  [R0805]  24.76 11.56 90 top
RF1  BWSMA-KE-P001  [SMA-SMD_BWSMA-KE-P001]  35.8 15 0 top
X1  25MHz  [OSC-SMD_4P-L7.0-W5.0-BL]  17.65 8.61 0 top

## Footprints (pads in the part's own frame, mm; a bottom-side part is the same pattern mirrored in y, then rotated)
C0805
  rect 1.41x1.35 smd: 1(-1,0) 2(1,0)
HDR-TH_2P-P2.54-V-M-1
  rect 1.8x1.8 hole 1: 1(-1.27,0)
  round 1.8 hole 1: 2(1.27,0)
HDR-TH_6P-P2.54-V-M-1
  rect 1.8x1.8 hole 1.2: 1(-6.35,0)
  round 1.8 hole 1.2: 2(-3.81,0) 3(-1.27,0) 4(1.27,0) 5(3.81,0) 6(6.35,0)
L0805
  rect 1.133x1.377 smd: 1(-0.966,0) 2(0.966,0)
LED0805-RD_RED
  rect 1x1.25 smd: 1(-1.1,0) 2(1.1,0)
m3x10-6
  round 3.2 hole 3.2: 1(-4.559,-4.356)
M3X10-6
  round 3.2 hole 3.2: 1(-0.33,-0.47)
m3x10-6#2
  round 3.2 hole 3.2: 1(-0.267,-1.042)
m3x10-6#3
  round 3.2 hole 3.2: 1(0.419,-0.064)
MSOP-10_L3.0-W3.0-P0.50-LS5.0-BL
  oval 0.28x1.62 smd: 1(-1,-2.11) 2(-0.5,-2.11) 3(0,-2.11) 4(0.5,-2.11) 5(1,-2.11) 6(1,2.11) 7(0.5,2.11) 8(0,2.11) 9(-0.5,2.11) 10(-1,2.11)
OSC-SMD_4P-L7.0-W5.0-BL
  rect 1.8x1.5 smd: 1(-2.64,-1.95) 2(2.64,-1.95) 3(2.64,1.95) 4(-2.64,1.95)
R0805
  rect 1.133x1.377 smd: 1(-1,0) 2(1,0)
SMA-SMD_BWSMA-KE-P001
  rect 4.8x1.2 smd: 1(0,-2.55) 2(0,2.55) 5(0,0)
  rect 4.8x1.2 smd far side: 3(0,2.55) 4(0,-2.55)

## Nets
As in the schematic.

Pads without a net: H1 1; H2 1; H3 1; H4 1; X1 1

## Via types
v1: diameter 0.61, hole 0.305, Top Layer to Bottom Layer, 85 vias

## Routing (per net, layer and track width the routed paths; a pad name or vN(x,y) marks a point on that pad's centre or on a via; arc(x,y) is an arc through that point)
AVDD: length 31.1
  Top Layer w0.254: IC1.2 18.04,20.85 17.78,20.59 17.78,19.19 17.53,18.94 C5.2
  Top Layer w0.508: 12.63,15 12.03,15.6 ; 12.63,15 R2.2 ; 12.63,15 12.63,16.2 ; 12.03,15.6 R1.1 ; 12.03,15.6 12.63,16.2 ; 12.63,16.2 12.63,20.89 ; 12.17,21.35 C3.2 C2.2 9.02,23.71 L1.2 ; 12.17,21.35 12.63,21.35 ; 12.17,21.35 12.63,20.89 ; 12.63,21.35 C8.2 C4.2 C5.2 ; 12.63,21.35 12.63,20.89 ; 12.63,20.89 13.09,21.35
GND: length 6.2
  Top Layer w0.254: IC1.4 21.36,19.85 22.35,20.84 24.02,20.84 IC1.9
  Top Layer w0.381: v1(21.84,6.66) X1.2
  vias: v1(5.59,19.35) v1(7.87,19.35) v1(7.87,17.13) v1(10.16,19.35) v1(15.05,16.94) v1(16.89,14.42) v1(17.44,17.98) v1(18.3,13.03) v1(19.38,14.42) v1(19.81,17.96) v1(20.46,13.03) v1(20.46,13.03) v1(21.35,21.35) v1(22.5,21.35) v1(23.24,22.24) v1(23.73,15.13) v1(24.49,22.24) v1(25.75,22.24) v1(27.05,22.71) v1(27.05,18.1) v1(27.05,16.78) v1(27.05,15.47) v1(27.05,14.16) v1(27.05,12.86) v1(28.07,18.08) v1(28.07,16.78) v1(28.07,15.47) v1(28.07,14.16) v1(28.07,12.86) v1(28.5,22.71) v1(29.18,12.86) v1(30.23,22.71) v1(30.3,12.86) v1(30.3,11.74) v1(30.3,10.62) v1(30.3,9.51) v1(30.55,8.65) v1(30.73,21.73) v1(30.73,20.61) v1(30.73,19.48) v1(30.73,18.36) v1(31.55,21.73) v1(31.55,20.61) v1(31.57,19.48) v1(31.62,8.39) v1(32.26,18.36) v1(32.38,22.24) v1(32.69,8.65) v1(32.85,12.96) v1(32.85,11.94) v1(32.95,10.62) v1(32.95,9.51) v1(33.5,22.24) v1(33.51,11.2) v1(33.64,13.75) v1(33.77,18.92) v1(33.77,16.28) v1(34.53,11.08) v1(34.61,22.24) v1(34.78,18.94) v1(35.04,16.28) v1(35.04,13.75) v1(35.72,22.24) v1(35.8,18.92) v1(35.8,11.08) v1(36.44,16.28) v1(36.44,13.75) v1(36.83,22.24) v1(37.07,18.92) v1(37.07,11.08) v1(37.34,21.35) v1(37.34,20.08) v1(37.83,16.28) v1(37.83,13.75) v1(38.34,18.92) v1(38.34,11.08) v1(38.97,17.55) v1(38.97,16.28) v1(38.97,15) v1(38.97,13.72) v1(38.97,12.45)
VDD: length 7.5
  Top Layer w0.508: J1.1 C1.2 6.73,23.71 L1.1
CLK0: length 2.4
  Top Layer w0.254: 20.55,10.56 22.99,10.56
EXTCLK: length 31.4
  Top Layer w0.254: 2.16,8.65 6.22,8.65 6.73,8.14 6.73,5.35 7.11,4.97 24.64,4.97 25.15,5.47 25.15,10.56
FOUT: length 12.8
  Top Layer w0.381: 33.02,15.25 32.77,15 ; 33.02,15.25 33.27,15 ; 33.02,15.25 J2.1 ; 32.77,15 L3.2 C11.1 ; 32.77,15 33.27,15 ; 33.27,15 RF1.5
FSYNC: length 34.1
  Top Layer w0.254: v1(26.03,12.33) 26.03,19.95 25.64,20.35 IC1.8
  Bottom Layer w0.254: v1(26.03,12.33) 5.46,12.33 4.32,11.19 2.16,11.19
SCLK: length 30.5
  Top Layer w0.254: IC1.7 25,19.85 25.4,19.44 v1(25.4,13.73)
  Bottom Layer w0.254: v1(25.4,13.73) 2.16,13.73
SDATA: length 26.4
  Top Layer w0.254: IC1.6 22.64,19.35 22.35,19.06 v1(22.35,15.13)
  Bottom Layer w0.254: v1(22.35,15.13) 5.46,15.13 4.32,16.27 2.16,16.27
SYSCLK: length 11.5
  Top Layer w0.254: IC1.5 21.3,19.35 21.59,19.06 21.59,12.76 21.79,12.56 R3.2 R4.2
$1N472: length 3.6
  Top Layer w0.254: IC1.1 16.22,21.35
$1N3416: length 7.4
  Top Layer w0.254: IC1.3 18.56,20.35 18.3,20.1 C6.2 C7.2
$1N4507: length 2.3
  Top Layer w0.254: R1.2 LED1.2
$1N4793: length 2.6
  Top Layer w0.254: R2.1 15.27,10.56
$1N5624: length 5.3
  Top Layer w0.254: C9.1 IC1.10
  Top Layer w0.381: C9.1 L2.1
$1N5630: length 4.8
  Top Layer w0.381: L2.2 C10.1 31.62,16.93

## Copper pours and planes (outline as drawn; the poured copper is in the pictures)
GND on Top Layer: 0,28 0.02,28.28 0.08,28.56 0.18,28.83 0.32,29.08 0.49,29.31 0.69,29.51 0.92,29.68 1.17,29.82 1.44,29.92 1.72,29.98 2,30 38,30 38.28,29.98 38.56,29.92 38.83,29.82 39.08,29.68 39.31,29.51 39.51,29.31 39.68,29.08 39.82,28.83 39.92,28.56 39.98,28.28 40,28 40,2 39.98,1.72 39.92,1.44 39.82,1.17 39.68,0.92 39.51,0.69 39.31,0.49 39.08,0.32 38.83,0.18 38.56,0.08 38.28,0.02 38,0 2,0 1.72,0.02 1.44,0.08 1.17,0.18 0.92,0.32 0.69,0.49 0.49,0.69 0.32,0.92 0.18,1.17 0.08,1.44 0.02,1.72 0,2
GND on Bottom Layer: 0,28 0.02,28.28 0.08,28.56 0.18,28.83 0.32,29.08 0.49,29.31 0.69,29.51 0.92,29.68 1.17,29.82 1.44,29.92 1.72,29.98 2,30 38,30 38.28,29.98 38.56,29.92 38.83,29.82 39.08,29.68 39.31,29.51 39.51,29.31 39.68,29.08 39.82,28.83 39.92,28.56 39.98,28.28 40,28 40,2 39.98,1.72 39.92,1.44 39.82,1.17 39.68,0.92 39.51,0.69 39.31,0.49 39.08,0.32 38.83,0.18 38.56,0.08 38.28,0.02 38,0 2,0 1.72,0.02 1.44,0.08 1.17,0.18 0.92,0.32 0.69,0.49 0.49,0.69 0.32,0.92 0.18,1.17 0.08,1.44 0.02,1.72 0,2

Small or netless copper shapes (teardrops, artwork), in the pictures only: 60 on Top Layer, 6 on Bottom Layer

## Text on the board
Top Silkscreen Layer: JLCJLCJLCJLC | EXTCLK | FSYNC | VDD | GND | SDATA | SCLK | FOUT | AD9833可编程波形发生器
